# Altium schematic sheet 48V-24V Buck Converter.SchDoc: Buck Converter
size B; CheckedBy: Lance Bantoto; Engineer: Farris Matar; Revision: 1; SheetNumber: 1; SheetTotal: 1
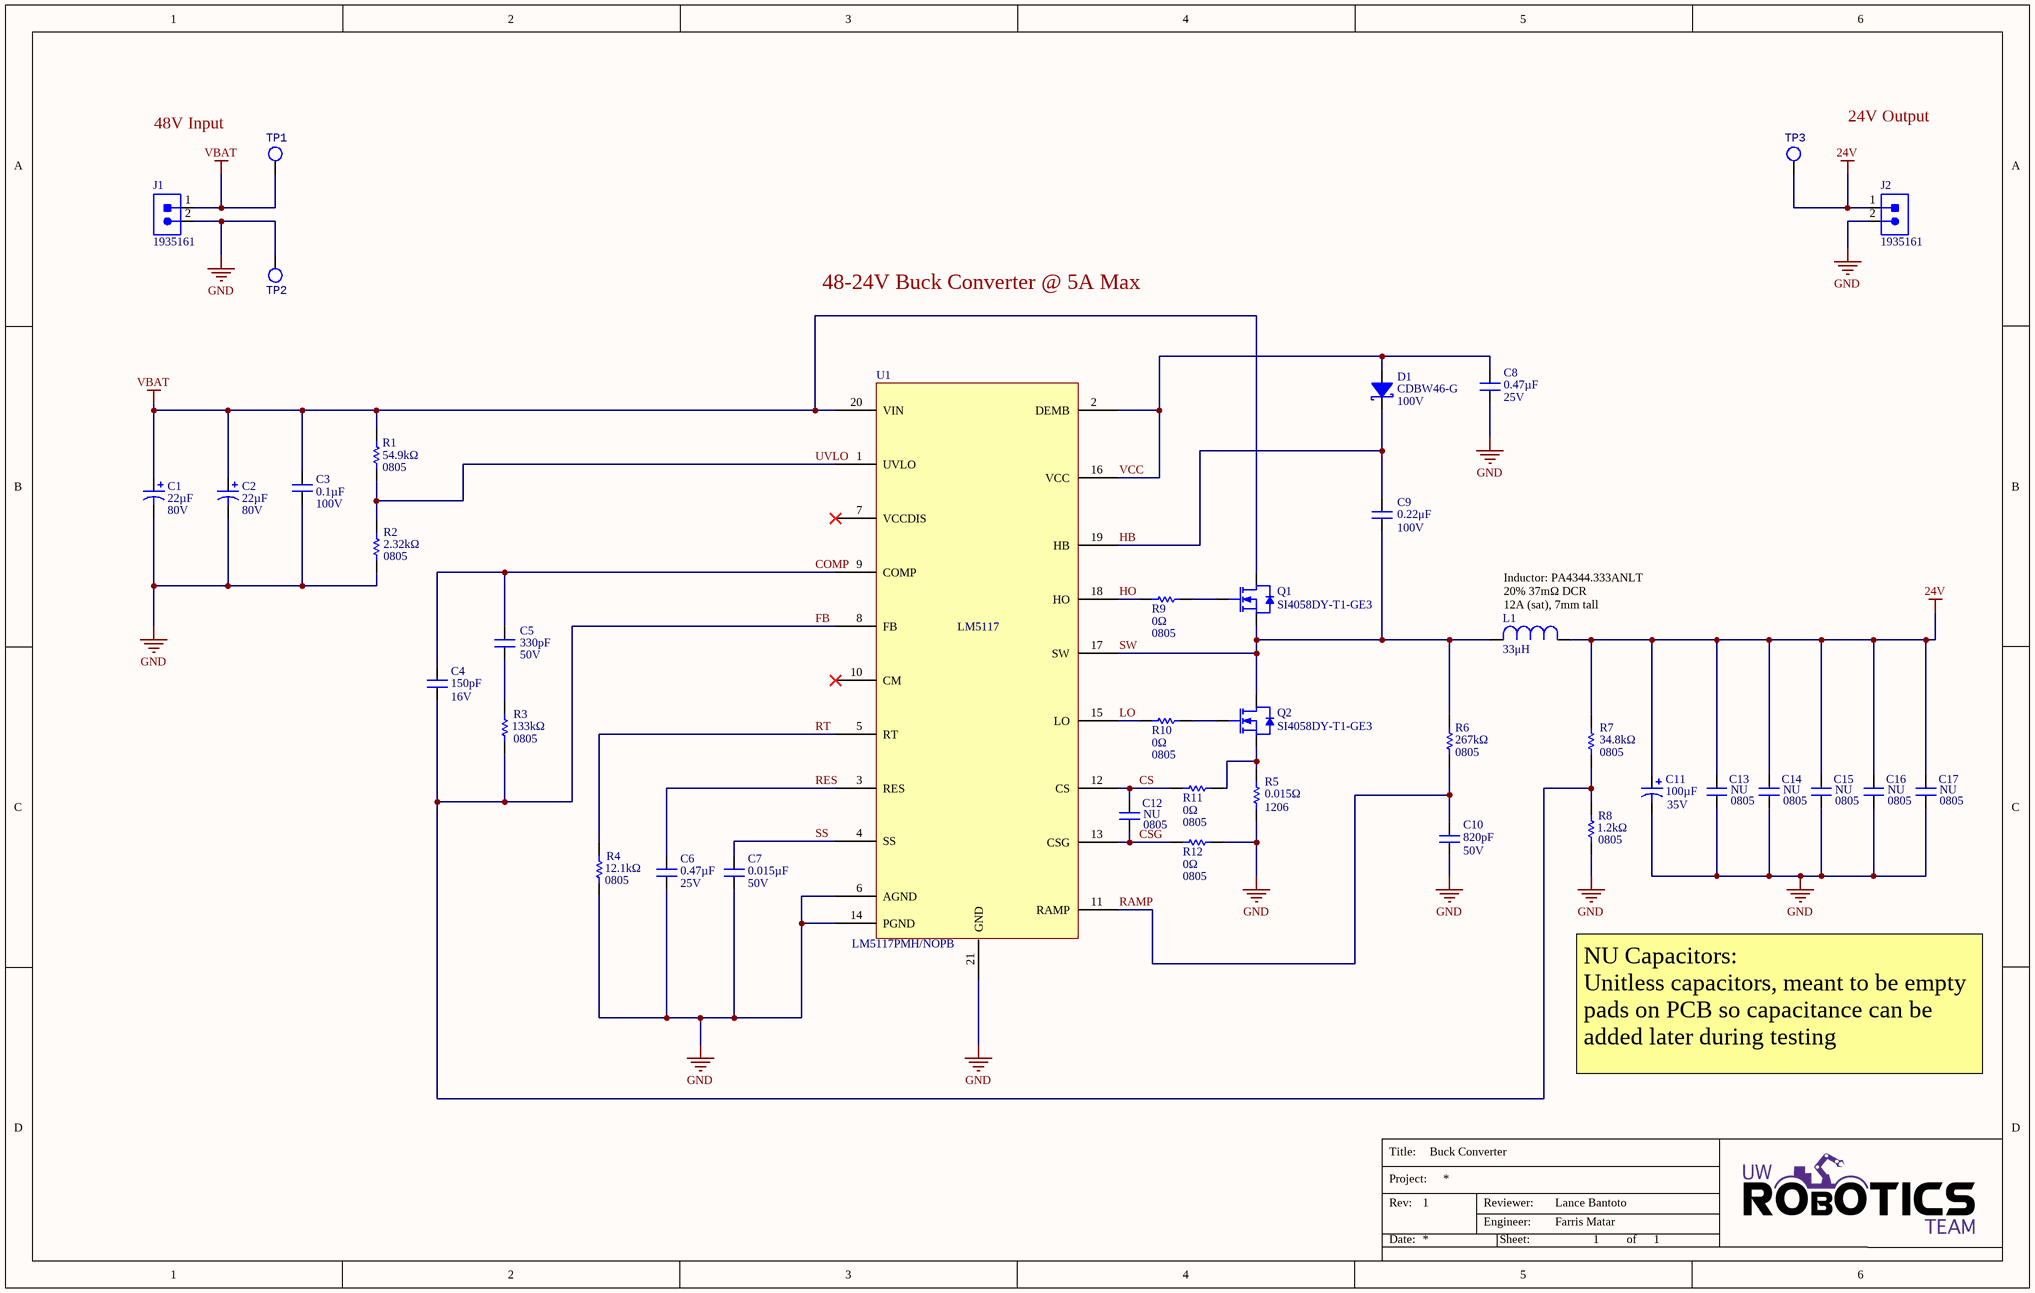
[diagram p0: 48V-24V Buck Converter.SchDoc]

## Parts
C1  value 22µF  Voltage Rating: 80V  [RADIAL_KEMET_KN]  (hidden comment: CAP_22uF_80V_ALUM)
C2  value 22µF  Voltage Rating: 80V  [RADIAL_KEMET_KN]  (hidden comment: CAP_22uF_80V_ALUM)
C3  value 0.1µF  Voltage Rating: 100V  [CAP0805]  (hidden comment: CAP_0.1uF_100V_0805)
C4  value 150pF  Voltage Rating: 16V  [CAP0805]  (hidden comment: CAP_150pF_16V_0805)
C5  value 330pF  Voltage Rating: 50V  [CAP0805]  (hidden comment: CAP_330pF_50V_0805)
C6  value 0.47µF  Voltage Rating: 25V  [CAP0805]  (hidden comment: CAP_0.47uF_25V_0805)
C7  value 0.015µF  Voltage Rating: 50V  [CAP0805]  (hidden comment: CAP_0.015uF_50V_0805)
C8  value 0.47µF  Voltage Rating: 25V  [CAP0805]  (hidden comment: CAP_0.47uF_25V_0805)
C9  value 0.22μF  Voltage Rating: 100V  [CAP2012]  (hidden comment: CAP_0.22uF_100V_0805)
C10  value 820pF  Voltage Rating: 50V  [CAP0805]  (hidden comment: CAP_820pF_50V_0805)
C11  value 100µF  Voltage Rating: 35V  [RADIAL_CORNELL_D]  (hidden comment: CAP_100uF_35V_ALUM)
C12  value NU  Package/Footprint: 0805  [CAP0805]  (hidden comment: CAP_NU_0805)
C13  value NU  Package/Footprint: 0805  [CAP0805]  (hidden comment: CAP_NU_0805)
C14  value NU  Package/Footprint: 0805  [CAP0805]  (hidden comment: CAP_NU_0805)
C15  value NU  Package/Footprint: 0805  [CAP0805]  (hidden comment: CAP_NU_0805)
C16  value NU  Package/Footprint: 0805  [CAP0805]  (hidden comment: CAP_NU_0805)
C17  value NU  Package/Footprint: 0805  [CAP0805]  (hidden comment: CAP_NU_0805)
D1  Manufacturer Part Number 1: CDBW46-G  Vr (Max): 100V  [SOD-123_FLAT]  (hidden comment: DIO_SCHOTTKY_100V_150mA)
J1  CON_2POS_SCREW_TERM  [1935161]  (value not drawn)
J2  CON_2POS_SCREW_TERM  [1935161]  (value not drawn)
L1  Inductance: 33μH  [IND_PULSE_PA4344]  (hidden comment: IND_33uH_12.0A)
Q1  Manufacturer Part Number 1: SI4058DY-T1-GE3  [8-SOIC_NMOS]  (hidden comment: NMOS_100V_10.3A)
Q2  Manufacturer Part Number 1: SI4058DY-T1-GE3  [8-SOIC_NMOS]  (hidden comment: NMOS_100V_10.3A)
R1  value 54.9kΩ  Package/Footprint: 0805  [RES0805]  (hidden comment: RES_54.9kΩ_0805_1%)
R2  value 2.32kΩ  Package/Footprint: 0805  [RES0805]  (hidden comment: RES_2.32kΩ_0805_1%)
R3  value 133kΩ  Package/Footprint: 0805  [RES0805]  (hidden comment: RES_133kΩ_0805_1%)
R4  value 12.1kΩ  Package/Footprint: 0805  [RES0805]  (hidden comment: RES_12.1kΩ_0805_1%)
R5  value 0.015Ω  Package/Footprint: 1206  [RES1206]  (hidden comment: RES_0.015Ω_1206_1%)
R6  value 267kΩ  Package/Footprint: 0805  [RES0805]  (hidden comment: RES_267kΩ_0805_1%)
R7  value 34.8kΩ  Package/Footprint: 0805  [RES0805]  (hidden comment: RES_34.8kΩ_0805_1%)
R8  value 1.2kΩ  Package/Footprint: 0805  [RES0805]  (hidden comment: RES_1.2kΩ_0805)
R9  value 0Ω  Package/Footprint: 0805  [RES0805]  (hidden comment: RES_0Ω_0805)
R10  value 0Ω  Package/Footprint: 0805  [RES0805]  (hidden comment: RES_0Ω_0805)
R11  value 0Ω  Package/Footprint: 0805  [RES0805]  (hidden comment: RES_0Ω_0805)
R12  value 0Ω  Package/Footprint: 0805  [RES0805]  (hidden comment: RES_0Ω_0805)
TP1  TESTPOINT_LOOP  [TESTPOINT_LOOP]  (value not drawn)
TP2  TESTPOINT_LOOP  [TESTPOINT_LOOP]  (value not drawn)
TP3  TESTPOINT_LOOP  [TESTPOINT_LOOP]  (value not drawn)
U1  Manufacturer Part Number 1: LM5117PMH/NOPB  [HTSSOP]  (hidden comment: BUCK_LM5117PWP)

## Nets
24V: C11.1 C13.2 C14.2 C15.2 C16.2 C17.2 J2.1 L1.1 R7.2 TP3.1
GND: C1.2 C2.2 C3.1 C6.1 C7.1 C8.1 C10.1 C11.2 C13.1 C14.1 C15.1 C16.1 C17.1 J1.2 J2.2 R2.1 R4.1 R5.1 R8.1 R12.2 TP2.1 U1.6(AGND) U1.14(PGND) U1.21(GND)
VBAT: C1.1 C2.1 C3.2 J1.1 Q1.3(Drain) R1.2 TP1.1 U1.20(VIN)
COMP: C4.2 C5.2 U1.9(COMP)
CS: C12.2 R11.1 U1.12(CS)
CSG: C12.1 R12.1 U1.13(CSG)
FB: C4.1 R3.1 R7.1 R8.2 U1.8(FB)
HB: C9.2 D1.2(Cathode) U1.19(HB)
HO: R9.1 U1.18(HO)
LO: R10.1 U1.15(LO)
RAMP: C10.2 R6.1 U1.11(RAMP)
RES: C6.2 U1.3(RES)
RT: R4.2 U1.5(RT)
SS: C7.2 U1.4(SS)
SW: C9.1 L1.2 Q1.2(Source) Q2.3(Drain) R6.2 U1.17(SW)
UVLO: R1.1 R2.2 U1.1(UVLO)
VCC: C8.2 D1.1(Anode) U1.2(DEMB) U1.16(VCC)
NetC5_1: C5.1 R3.2
NetQ1_1: Q1.1(Gate) R9.2
NetQ2_1: Q2.1(Gate) R10.2
NetQ2_2: Q2.2(Source) R5.2 R11.2

Not connected (* = marked no-connect by the designer): U1 7(VCCDIS)* 10(CM)*

## Notes on the sheet
- 48V Input
- 24V Output
- 48-24V Buck Converter @ 5A Max
- Inductor: PA4344.333ANLT
- (near L1) 20% 37mΩ DCR
- (near L1) 12A (sat), 7mm tall
- NU Capacitors:
  Unitless capacitors, meant to be empty
  pads on PCB so capacitance can be
  added later during testing
- Title:
- Project:
- Date:
- Rev:
- Reviewer:
- Engineer:
- Sheet:
- of
- (in symbol BUCK_LM5117PWP) LM5117

## Library data of the parts
C1 C2 = CAP_22uF_80V_ALUM: CAP ALUM POLY 22UF 20% 80V SMD; Manufacturer 1: KEMET; Manufacturer Part Number 1: A767KN226M1KLAE045; Mounting Type: SMD; Package/Footprint: SMD; Supplier 1: Digi-Key; Supplier Part Number 1: 399-15649-1-ND
C3 = CAP_0.1uF_100V_0805: CAP CER 0.1UF 100V X7R 0805; Manufacturer 1: TDK Corporation; Manufacturer Part Number 1: C2012X7R2A104K125AA; Package/Footprint: 0805; Supplier 1: Digi-Key; Supplier Part Number 1: 445-1418-1-ND
C4 = CAP_150pF_16V_0805: CAP CER 150PF 16V X7R 0805; Manufacturer 1: Würth Elektronik; Manufacturer Part Number 1: 885012207028; Package/Footprint: 0805; Supplier 1: Digi-Key; Supplier Part Number 1: 732-8028-1-ND
C5 = CAP_330pF_50V_0805: CAP CER 330PF 50V C0G/NPO 0805; Manufacturer 1: Yageo; Manufacturer Part Number 1: CC0805JRNPO9BN331; Package/Footprint: 0805; Supplier 1: Digi-Key; Supplier Part Number 1: 311-1117-1-ND
C6 C8 = CAP_0.47uF_25V_0805: CAP CER 0.47UF 25V X5R 0805; Manufacturer 1: KEMET; Manufacturer Part Number 1: C0805C474K3PAC7800; Package/Footprint: 0805; Supplier 1: Digi-Key; Supplier Part Number 1: 399-15508-1-ND
C7 = CAP_0.015uF_50V_0805: CAP CER 0.015UF 50V C0G 0805; Manufacturer 1: TDK Corporation; Manufacturer Part Number 1: CGA4F2C0G1H153J085AA; Package/Footprint: 0805; Supplier 1: Digi-Key; Supplier Part Number 1: 445-6948-1-ND
C9 = CAP_0.22uF_100V_0805: CAP CER 0.22UF 100V X7R 0805; Manufacturer 1: Taiyo Yuden; Manufacturer Part Number 1: HMJ212BB7224KGHT; Package/Footprint: 0805; Supplier 1: Digi-Key; Supplier Part Number 1: 587-4221-1-ND; Mounting Type: SMD; Dielectric: X7R
C10 = CAP_820pF_50V_0805: CAP CER 820PF 50V C0G/NP0 0805; Manufacturer 1: KEMET; Manufacturer Part Number 1: C0805X821J5GAC7800; Package/Footprint: 0805; Supplier 1: Digi-Key; Supplier Part Number 1: 399-19481-1-ND
C11 = CAP_100uF_35V_ALUM: CAP ALUM 100UF 20% 35V SMD; Manufacturer 1: Rubycon; Manufacturer Part Number 1: 35TKV100M8X10.5; Mounting Type: SMD; Package/Footprint: SMD; Supplier 1: Digi-Key; Supplier Part Number 1: 1189-2074-1-ND
C12-C17 = CAP_NU_0805: PLACEHOLDER CAPACITOR 0805; Mounting Type: SMD
D1 = DIO_SCHOTTKY_100V_150mA: DIODE SCHOTTKY 100V 150MA SOD123; Manufacturer 1: Comchip Technology; Package/Footprint: SOD-123; Mounting Type: SMD; Supplier 1: Digi-Key; Supplier Part Number 1: 641-1964-1-ND
J1 J2 = CON_2POS_SCREW_TERM: TERM BLK 2POS SIDE ENTRY 5MM; Manufacturer 1: Phoenix Contact; Package/Footprint: SMD; Supplier 1: Digi-Key; Mounting Type: TH; Supplier Part Number 1: 277-1667-ND; Manufacturer Part Number 1: 1935161
L1 = IND_33uH_12.0A: FIXED IND 33UH 12A 37 MOHM SMD; Manufacturer 1: Pulse Electronics Power; Manufacturer Part Number 1: PA4344.333ANLT; DC Resistance (DCR): 37mR; Inductance Tolerance: 20%; Test Frequency: 100kHz; Saturation Current: 12A; Current Rating: 12A; Mounting Type: SMD; Supplier 1: Digi-Key; Supplier Part Number 1: 553-4036-1-ND
Q1 Q2 = NMOS_100V_10.3A: MOSFET N-CH 100V 10.3A 8SOIC; Manufacturer 1: Vishay Siliconix; Vgs (Max): ±20V; Package/Footprint: 8-SOIC; Supplier 1: Digi-Key; Supplier Part Number 1: SI4058DY-T1-GE3CT-ND; Vdss: 100V; Id: 10.3A
R1 = RES_54.9kΩ_0805_1%: RES SMD 54.9K OHM 1% 1/8W 0805; Manufacturer 1: Panasonic Electronic Components; Manufacturer Part Number 1: ERJ-6ENF5492V; Supplier 1: Digi-Key; Supplier Part Number 1: P54.9KCCT-ND
R2 = RES_2.32kΩ_0805_1%: RES 2.32K OHM 1% 1/4W 0805; Manufacturer 1: Stackpole Electronics Inc; Manufacturer Part Number 1: RNCP0805FTD2K32; Supplier 1: Digi-Key; Supplier Part Number 1: RNCP0805FTD2K32CT-ND
R3 = RES_133kΩ_0805_1%: RES SMD 133K OHM 1% 1/8W 0805; Manufacturer 1: Yageo; Manufacturer Part Number 1: RC0805FR-07133KL; Supplier 1: Digi-Key; Supplier Part Number 1: 311-133KCRCT-ND
R4 = RES_12.1kΩ_0805_1%: RES 12.1K OHM 1% 1/4W 0805; Manufacturer 1: Stackpole Electronics Inc; Manufacturer Part Number 1: RNCP0805FTD12K1; Supplier 1: Digi-Key; Supplier Part Number 1: RNCP0805FTD12K1CT-ND
R5 = RES_0.015Ω_1206_1%: RES 0.015 OHM 1% 1/2W 1206; Manufacturer 1: Rohm Semiconductor; Manufacturer Part Number 1: UCR18EVHFSR015; Supplier 1: Digi-Key; Supplier Part Number 1: RHM1305CT-ND
R6 = RES_267kΩ_0805_1%: RES SMD 267K OHM 1% 1/8W 0805; Manufacturer 1: Yageo; Manufacturer Part Number 1: RC0603FR-071K2L; Supplier 1: Digi-Key; Supplier Part Number 1: 311-267KCRCT-ND
R7 = RES_34.8kΩ_0805_1%: RES 34.8K OHM 1% 1/8W 0805; Manufacturer 1: Stackpole Electronics Inc; Manufacturer Part Number 1: RMCF0805FT34K8; Supplier 1: Digi-Key; Supplier Part Number 1: RMCF0805FT34K8CT-ND
R8 = RES_1.2kΩ_0805_1%: RES SMD 1.2K OHM 1% 1/8W 0805; Manufacturer 1: Samsung Electro-Mechanics; Manufacturer Part Number 1: RC2012F122CS; Supplier 1: Digi-Key; Supplier Part Number 1: 1276-5275-2-ND
R9-R12 = RES_0Ω_0805: RES 0 OHM JUMPER 1/8W 0805; Manufacturer 1: Panasonic Electronic Components; Manufacturer Part Number 1: ERJ-6GEY0R00V; Supplier Part Number 1: P0.0ACT-ND; Supplier 1: Digi-Key; Mounting Type: SMD; LCSC Part #: C17477
TP1-TP3 = TESTPOINT_LOOP: TESTPOINT THRUHOLE; Manufacturer 1: Keystone Electronics; Manufacturer Part Number 1: 5002; Package/Footprint: TH; Supplier 1: Digi-Key; Mounting Type: TH; Supplier Part Number 1: 36-5002-ND
U1 = BUCK_LM5117PWP: IC REG CTRLR BUCK 20TSSOP; Manufacturer 1: Texas Instruments; Package/Footprint: 20-HTSSOP; Mounting Type: SMD; Supplier 1: Digi-Key; Supplier Part Number 1: 296-41310-1-ND